# Altium schematic sheet IMU.SchDoc
size A
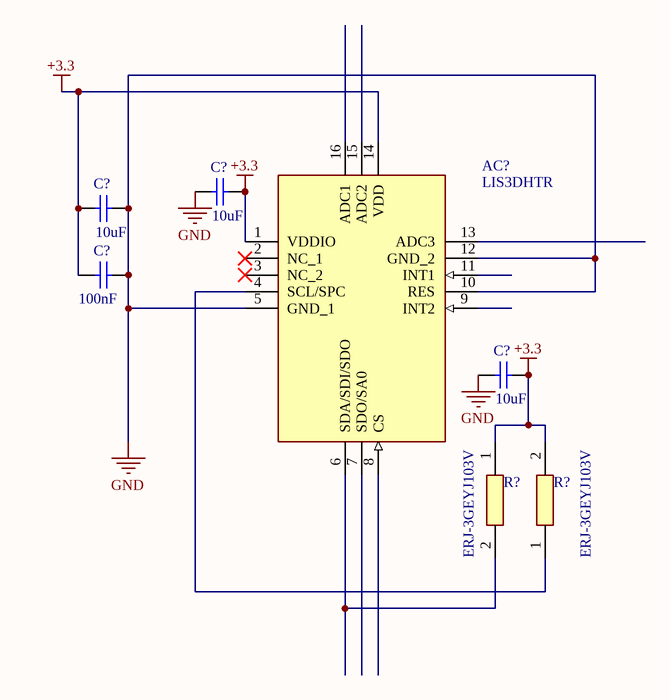
[diagram p0: IMU.SchDoc]

## Parts
(Parts that share a designator on the sheet are numbered #1, #2 ... from top to bottom, then left to right.)
AC?  LIS3DHTR  [LIS3DHTR]
C?#1  value 10uF  [C0805]  (hidden comment: Cap)
C?#2  value 10uF  [C0805]  (hidden comment: Cap)
C?#3  value 100nF  [C0805]  (hidden comment: 10V)
C?#4  value 10uF  [C0805]  (hidden comment: Cap)
R?#1  ERJ-3GEYJ103V  [RESC1608X55N]
R?#2  ERJ-3GEYJ103V  [RESC1608X55N]

## Nets
+3.3: AC?.1(VDDIO) AC?.14(VDD) C?#1.2 C?#2.1 C?#3.1 C?#4.2 R?#1.1 R?#2.2
GND: AC?.5(GND_1) AC?.10(RES) AC?.12(GND_2) C?#1.1 C?#2.2 C?#3.2 C?#4.1
NetAC?_4: AC?.4(SCL/SPC) R?#2.1
NetAC?_6: AC?.6(SDA/SDI/SDO) R?#1.2

Not connected (* = marked no-connect by the designer): AC? 2(NC_1)* 3(NC_2)* 7(SDO/SA0) 8(CS) 9(INT2) 11(INT1) 13(ADC3) 15(ADC2) 16(ADC1)

## Library data of the parts
AC? = LIS3DHTR: Accelerometer; Manufacturer_Name: STMicroelectronics; Datasheet Link: http://www.st.com/content/ccc/resource/technical/document/datasheet/3c/ae/50/85/d6/b1/46/fe/CD00274221.pdf/files/CD00274221.pdf/jcr:content/translations/en.CD00274221.pdf; Height: 1mm; Manufacturer_Part_Number: LIS3DHTR; Mouser Part Number: 511-LIS3DHTR; Mouser Price/Stock: https://www.mouser.co.uk/ProductDetail/STMicroelectronics/LIS3DHTR/?qs=6la6oa3D8xzhXYax3cEo4w%3D%3D; Arrow Part Number: LIS3DHTR; Arrow Price/Stock: https://www.arrow.com/en/products/lis3dhtr/stmicroelectronics
C?#1 C?#2 C?#4 = Cap: Capacitor; Published: 8-Jun-2000; LatestRevisionDate: 17-Jul-2002; LatestRevisionNote: Re-released for DXP Platform.; PackageReference: RAD-0.3; Publisher: Altium Limited; PackageDescription: Radial Cap, Thru-Hole; 2 Leads; 0.3 in Pin Spacing
C?#3 = Cap: C0805C104K8RACTU. 0.1µF ±10% 10V Ceramic Capacitor X7R 0805 (2012 Metric) /; Published: 8-Jun-2000; LatestRevisionDate: 17-Jul-2002; LatestRevisionNote: Re-released for DXP Platform.; PackageReference: RAD-0.3; Publisher: Altium Limited; PackageDescription: Radial Cap, Thru-Hole; 2 Leads; 0.3 in Pin Spacing
R?#1 R?#2 = ERJ-3GEYJ103V: Resistor; Manufacturer_Name: Panasonic; Datasheet Link: http://docs-emea.rs-online.com/webdocs/13ba/0900766b813ba21b.pdf; Height: 0.55mm; Manufacturer_Part_Number: ERJ-3GEYJ103V; Mouser Part Number: 667-ERJ-3GEYJ103V; Mouser Price/Stock: https://www.mouser.co.uk/ProductDetail/Panasonic/ERJ-3GEYJ103V/?qs=66DK8nO8gJBWgc%252B0VNNxzg%3D%3D; Arrow Part Number: ERJ-3GEYJ103V; Arrow Price/Stock: https://www.arrow.com/en/products/erj-3geyj103v/panasonic